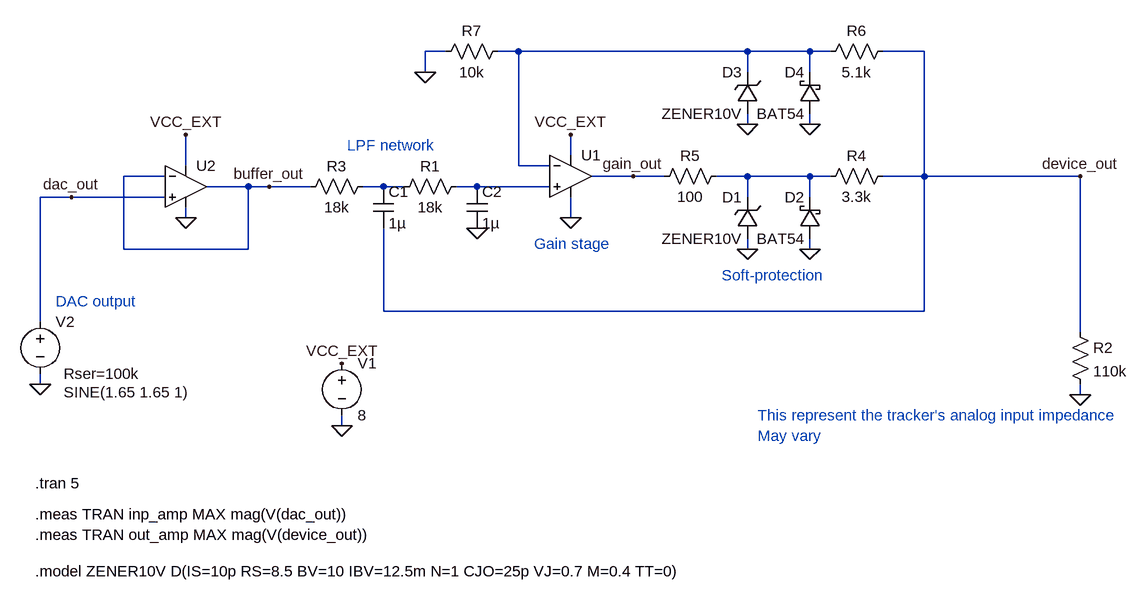
[diagram p0: schematic External Filter Gain - AC Chars.asc]
External Filter Gain - AC Chars.asc, the LTspice schematic file:
Version 4.1
SHEET 1 2168 1080
WIRE 640 -352 608 -352
WIRE 752 -352 720 -352
WIRE 1104 -352 752 -352
WIRE 1200 -352 1104 -352
WIRE 1232 -352 1200 -352
WIRE 1376 -352 1312 -352
WIRE 608 -320 608 -352
WIRE 1104 -320 1104 -352
WIRE 1200 -320 1200 -352
WIRE 1104 -240 1104 -256
WIRE 1200 -240 1200 -256
WIRE 832 -192 832 -224
WIRE 240 -176 240 -224
WIRE 752 -176 752 -352
WIRE 800 -176 752 -176
WIRE 208 -160 144 -160
WIRE 928 -160 864 -160
WIRE 976 -160 928 -160
WIRE 1104 -160 1056 -160
WIRE 1200 -160 1104 -160
WIRE 1232 -160 1200 -160
WIRE 1376 -160 1376 -352
WIRE 1376 -160 1312 -160
WIRE 1616 -160 1376 -160
WIRE 336 -144 272 -144
WIRE 368 -144 336 -144
WIRE 432 -144 368 -144
WIRE 544 -144 512 -144
WIRE 576 -144 544 -144
WIRE 688 -144 656 -144
WIRE 800 -144 688 -144
WIRE 64 -128 16 -128
WIRE 208 -128 64 -128
WIRE 1104 -128 1104 -160
WIRE 1200 -128 1200 -160
WIRE 240 -96 240 -112
WIRE 832 -96 832 -128
WIRE 144 -48 144 -160
WIRE 336 -48 336 -144
WIRE 336 -48 144 -48
WIRE 1104 -48 1104 -64
WIRE 1200 -48 1200 -64
WIRE 544 48 544 -80
WIRE 1376 48 1376 -160
WIRE 1376 48 544 48
WIRE 16 64 16 -128
WIRE 1616 80 1616 -160
WIRE 16 160 16 144
WIRE 1616 176 1616 160
WIRE 480 224 480 208
FLAG 688 -80 0
FLAG 1616 176 0
FLAG 832 -96 0
FLAG 480 224 0
FLAG 16 160 0
FLAG 832 -224 VCC_EXT
FLAG 480 128 VCC_EXT
FLAG 1104 -48 0
FLAG 1200 -48 0
FLAG 608 -320 0
FLAG 1104 -240 0
FLAG 1200 -240 0
FLAG 1616 -160 device_out
FLAG 928 -160 gain_out
FLAG 240 -96 0
FLAG 64 -128 dac_out
FLAG 368 -144 buffer_out
FLAG 240 -224 VCC_EXT
SYMBOL res 672 -160 R90
WINDOW 0 0 56 VBottom 2
WINDOW 3 32 56 VTop 2
SYMATTR InstName R1
SYMATTR Value 18k
SYMBOL res 528 -160 R90
WINDOW 0 0 56 VBottom 2
WINDOW 3 32 56 VTop 2
SYMATTR InstName R3
SYMATTR Value 18k
SYMBOL cap 672 -144 R0
SYMATTR InstName C2
SYMATTR Value 1µ
SYMBOL res 1600 64 R0
SYMATTR InstName R2
SYMATTR Value 110k
SYMBOL voltage 480 112 R0
WINDOW 123 0 0 Left 0
WINDOW 39 0 0 Left 0
SYMATTR InstName V1
SYMATTR Value 8
SYMBOL voltage 16 48 R0
WINDOW 123 38 126 Left 2
WINDOW 39 36 96 Left 2
WINDOW 3 36 124 Left 2
SYMATTR SpiceLine Rser=100k
SYMATTR Value SINE(1.65 1.65 1)
SYMATTR InstName V2
SYMBOL res 1328 -176 R90
WINDOW 0 0 56 VBottom 2
WINDOW 3 32 56 VTop 2
SYMATTR InstName R4
SYMATTR Value 3.3k
SYMBOL zener 1120 -64 R180
WINDOW 0 24 64 Left 2
WINDOW 3 24 0 Left 2
SYMATTR InstName D1
SYMATTR Value ZENER10V
SYMATTR Description Diode
SYMATTR Type diode
SYMBOL schottky 1216 -64 R180
WINDOW 0 24 64 Left 2
WINDOW 3 24 0 Left 2
SYMATTR InstName D2
SYMATTR Value BAT54
SYMATTR Description Diode
SYMATTR Type diode
SYMBOL res 1072 -176 R90
WINDOW 0 0 56 VBottom 2
WINDOW 3 32 56 VTop 2
SYMATTR InstName R5
SYMATTR Value 100
SYMBOL cap 528 -144 R0
SYMATTR InstName C1
SYMATTR Value 1µ
SYMBOL res 1328 -368 R90
WINDOW 0 0 56 VBottom 2
WINDOW 3 32 56 VTop 2
SYMATTR InstName R6
SYMATTR Value 5.1k
SYMBOL res 736 -368 R90
WINDOW 0 0 56 VBottom 2
WINDOW 3 32 56 VTop 2
SYMATTR InstName R7
SYMATTR Value 10k
SYMBOL schottky 1216 -256 R180
WINDOW 0 24 64 Left 2
WINDOW 3 24 0 Left 2
SYMATTR InstName D4
SYMATTR Value BAT54
SYMATTR Description Diode
SYMATTR Type diode
SYMBOL OpAmps\\UniversalOpAmp2 832 -160 R0
SYMATTR InstName U1
SYMBOL OpAmps\\UniversalOpAmp2 240 -144 R0
SYMATTR InstName U2
SYMBOL zener 1120 -256 R180
WINDOW 0 24 64 Left 2
WINDOW 3 24 0 Left 2
SYMATTR InstName D3
SYMATTR Value ZENER10V
SYMATTR Description Diode
SYMATTR Type diode
TEXT 40 32 Left 2 ;DAC output
TEXT 1064 -8 Left 2 ;Soft-protection
TEXT 488 -208 Left 2 ;LPF network
TEXT 1120 208 Left 2 ;This represent the tracker's analog input impedance\nMay vary
TEXT 776 -56 Left 2 ;Gain stage
TEXT 8 312 Left 2 !.tran 5
TEXT 8 448 Left 2 !.model ZENER10V D(IS=10p RS=8.5 BV=10 IBV=12.5m N=1 CJO=25p VJ=0.7 M=0.4 TT=0)
TEXT 8 360 Left 2 !.meas TRAN inp_amp MAX mag(V(dac_out))\n.meas TRAN out_amp MAX mag(V(device_out))

The netlist it stands for:
* External Filter Gain - AC Chars.asc
R1 N004 N003 18k
R3 N003 buffer_out 18k
C2 N004 0 1µ
R2 device_out 0 110k
V1 VCC_EXT 0 8
V2 dac_out 0 SINE(1.65 1.65 1) Rser=100k
R4 device_out N002 3.3k
D1 0 N002 ZENER10V
D2 0 N002 BAT54
R5 N002 gain_out 100
C1 N003 device_out 1µ
R6 device_out N001 5.1k
R7 N001 0 10k
D4 0 N001 BAT54
X§U1 N004 N001 VCC_EXT 0 gain_out level2 Avol=1Meg GBW=10Meg Slew=10Meg Ilimit=25m Rail=0 Vos=0 En=0 Enk=0 In=0 Ink=0 Rin=500Meg  ; pins In+ In- V+ V- OUT
X§U2 dac_out buffer_out VCC_EXT 0 buffer_out level2 Avol=1Meg GBW=10Meg Slew=10Meg Ilimit=25m Rail=0 Vos=0 En=0 Enk=0 In=0 Ink=0 Rin=500Meg  ; pins In+ In- V+ V- OUT
D3 0 N001 ZENER10V
.model D D
.lib standard.dio
* DAC output
* Soft-protection
* LPF network
* This represent the tracker's analog input impedance
* May vary
* Gain stage
.tran 5
.model ZENER10V D(IS=10p RS=8.5 BV=10 IBV=12.5m N=1 CJO=25p VJ=0.7 M=0.4 TT=0)
.meas TRAN inp_amp MAX mag(V(dac_out))
.meas TRAN out_amp MAX mag(V(device_out))
.lib UniversalOpAmp2.lib
.backanno
.end